# Altium schematic sheet SallenKey_SCH.SchDoc
size A4
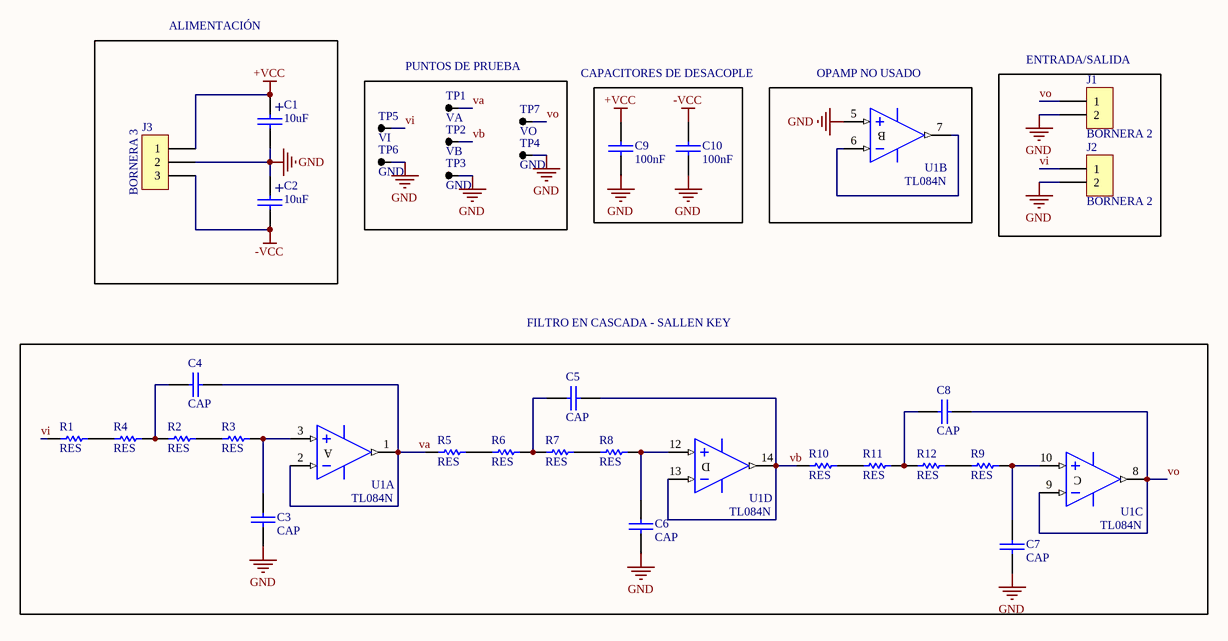
[diagram p0: SallenKey_SCH.SchDoc]

## Parts
C1  10uF  [CAP100RP]
C2  10uF  [CAP100RP]
C3  CAP  [0805]
C4  CAP  [0805]
C5  CAP  [0805]
C6  CAP  [0805]
C7  CAP  [0805]
C8  CAP  [0805]
C9  100nF  [0805]
C10  100nF  [0805]
J1  BORNERA 2  [BORNERA2]
J2  BORNERA 2  [BORNERA2]
J3  BORNERA 3  [BORNERA3]
R1  RES  [0805]
R2  RES  [0805]
R3  RES  [0805]
R4  RES  [0805]
R5  RES  [0805]
R6  RES  [0805]
R7  RES  [0805]
R8  RES  [0805]
R9  RES  [0805]
R10  RES  [0805]
R11  RES  [0805]
R12  RES  [0805]
TP1  VA  [TPTH]
TP2  VB  [TPTH]
TP3  GND  [TPTH]
TP4  GND  [TPTH]
TP5  VI  [TPTH]
TP6  GND  [TPTH]
TP7  VO  [TPTH]
U1  TL084N  [N014]  (parts A,B,C,D of 4)

## Blocks framed on the sheet
ALIMENTACIÓN: C1 C2 J3
PUNTOS DE PRUEBA: TP1-TP7
OPAMP NO USADO: U1
ENTRADA/SALIDA: J1 J2
FILTRO EN CASCADA - SALLEN KEY: C3-C8 R1-R12 U1

## Nets
+VCC: C1.1 C9.1 J3.1 U1.4(V+)
-VCC: C2.2 C10.1 J3.3 U1.11(V-)
GND: C1.2 C2.1 C3.2 C6.2 C7.2 C9.2 C10.2 J1.2 J2.2 J3.2 TP3.1 TP4.1 TP6.1 U1.5(IN+)
va: C4.1 R5.1 TP1.1 U1.1(OUT) U1.2(IN-)
vb: C5.1 R10.1 TP2.1 U1.13(IN-) U1.14(OUT)
vi: J2.1 R1.1 TP5.1
vo: C8.1 J1.1 TP7.1 U1.8(OUT) U1.9(IN-)
NetC3_1: C3.1 R3.2 U1.3(IN+)
NetC4_2: C4.2 R2.1 R4.2
NetC5_2: C5.2 R6.2 R7.1
NetC6_1: C6.1 R8.2 U1.12(IN+)
NetC7_1: C7.1 R9.2 U1.10(IN+)
NetC8_2: C8.2 R11.2 R12.1
NetR1_2: R1.2 R4.1
NetR2_2: R2.2 R3.1
NetR5_2: R5.2 R6.1
NetR7_2: R7.2 R8.1
NetR9_1: R9.1 R12.2
NetR10_2: R10.2 R11.1
NetU1_6: U1.6(IN-) U1.7(OUT)

## Notes on the sheet
- CAPACITORES DE DESACOPLE
- (in symbol CAPPOL) +
- (in symbol TL084N, part A) A
- (in symbol TL084N, part B) B
- (in symbol TL084N, part C) C
- (in symbol TL084N, part D) D

## Library data of the parts
C1 C2 = CAPPOL: Value: 10uF; Footprint: THT
C9 C10 = CAP: Value: 100nF; Footprint: SMD0805
TP1-TP7 = TP: Value: Pin Macho; Footprint: Pin Macho
U1 = TL084N: JFET-Input Operational Amplifier; Value: TL084; Footprint: DIP14
C3-C8 = CAP: Value: *; Footprint: SMD0805
J1 J2 = BORNERA 2: Value: BORNERA2
J3 = BORNERA 3: Value: BORNERA3
R1-R12 = RES: Value: *; Footprint: SMD0805